# EAGLE design 2Lyonel (EAGLE 7.4.0)
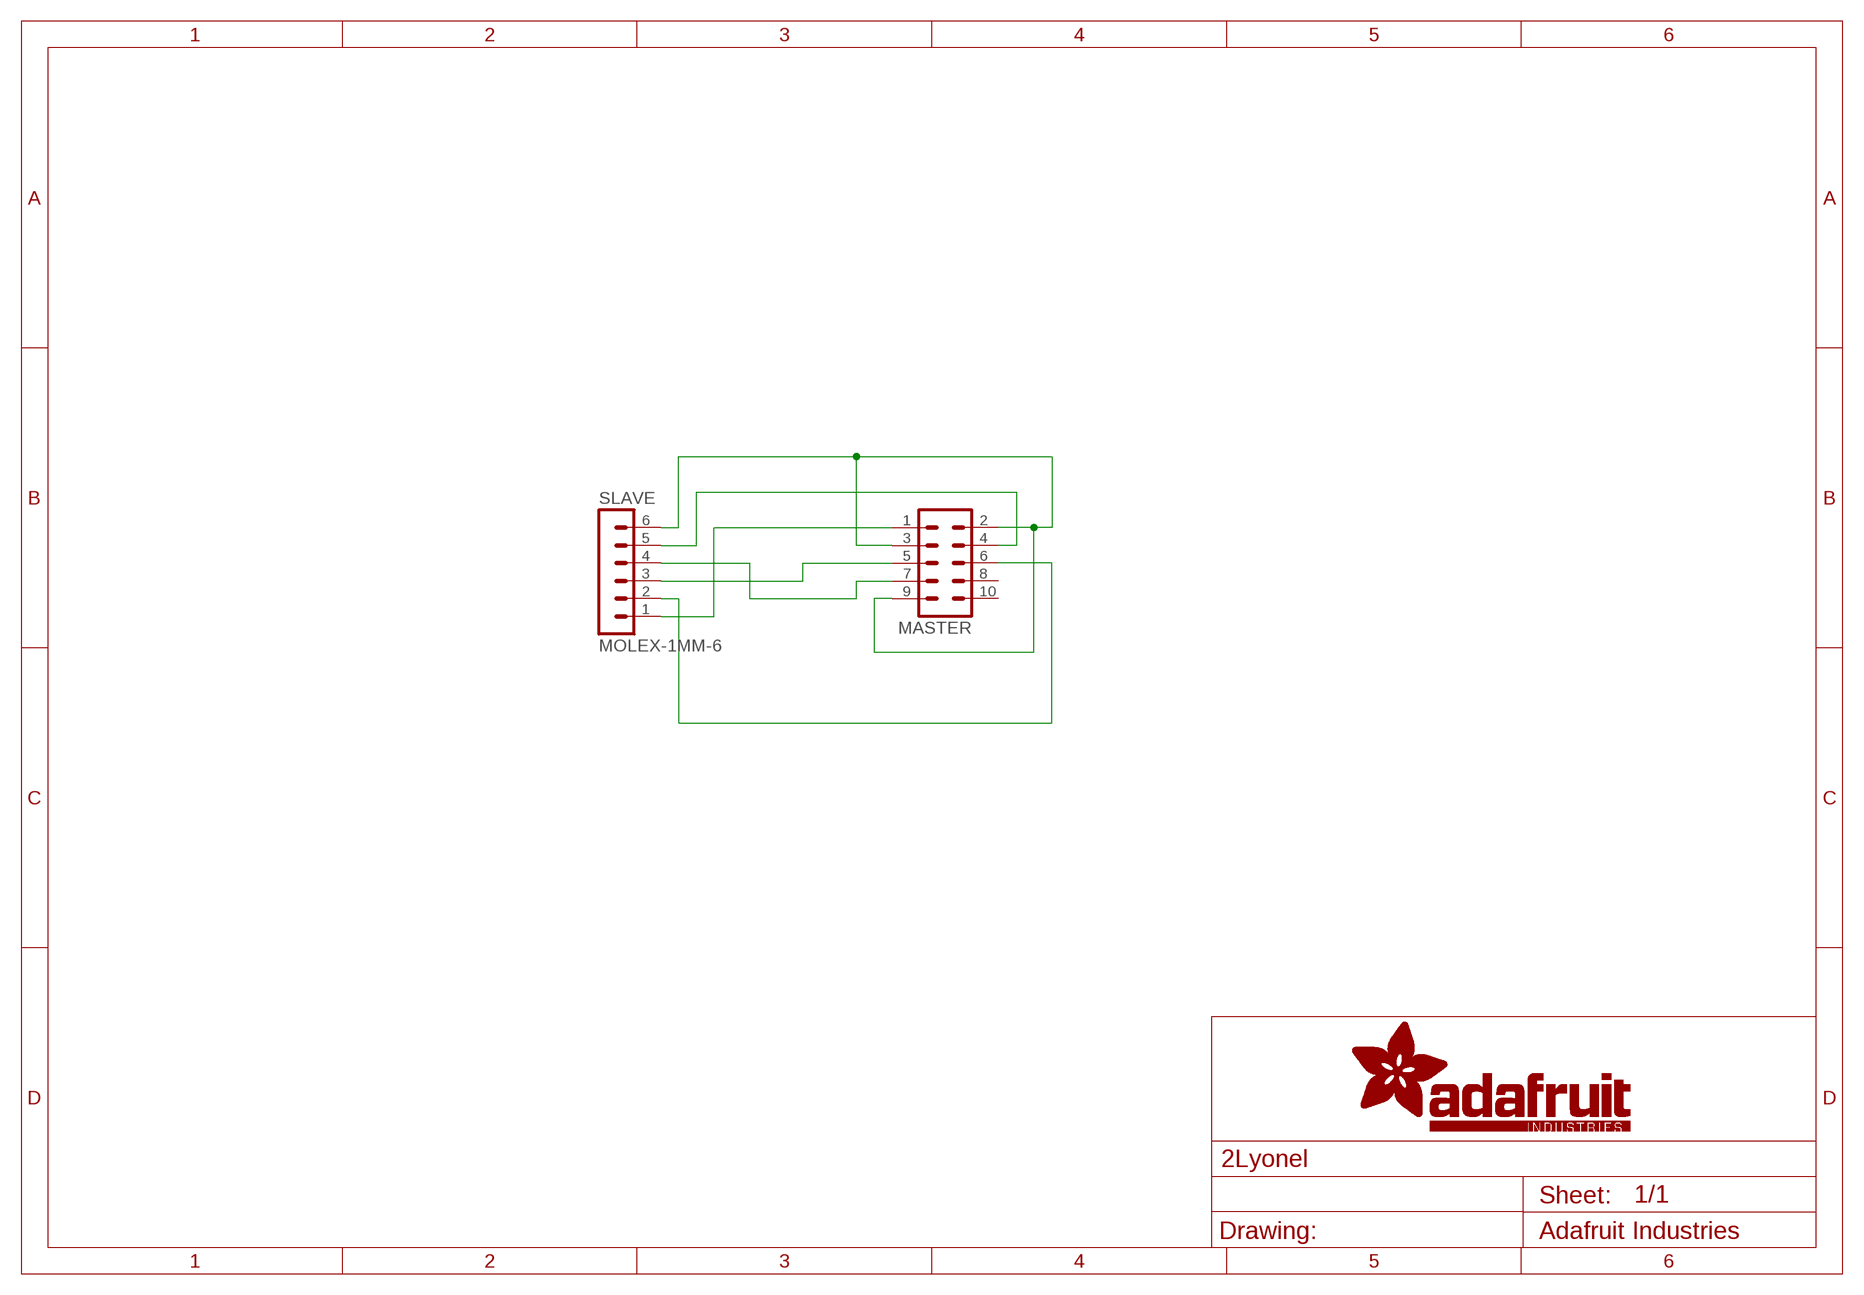
[diagram p0: schematic, sheet 1]

## Parts
MASTER  MA05-2  [MA05-2]
SLAVE  MOLEX-1MM-6  MA06-1  [MOLEX-1MM-6]

## Nets
N$1: MASTER.6 SLAVE.2
N$2: MASTER.1 SLAVE.1
N$3: MASTER.5 SLAVE.3
N$4: MASTER.7 SLAVE.4
N$5: MASTER.4 SLAVE.5
N$6: MASTER.2 MASTER.3 MASTER.9 SLAVE.6
Unconnected: MASTER.8 MASTER.10

## Library data of the parts
MASTER = studio_h:MA05-2: PIN HEADER; MF: TE CONNECTIVITY; MPN: 4-146251-0; Z_DIGIKEY: A117616-ND; Z_MOUSER: 571-4-146251-0
SLAVE = studio_h:MA06-1; MF: MOLEX; MPN: 52207-0633; Z_DIGIKEY: WM10938CT-ND; Z_MOUSER: 538-52207-0633; Z_SMT: Y

## Board
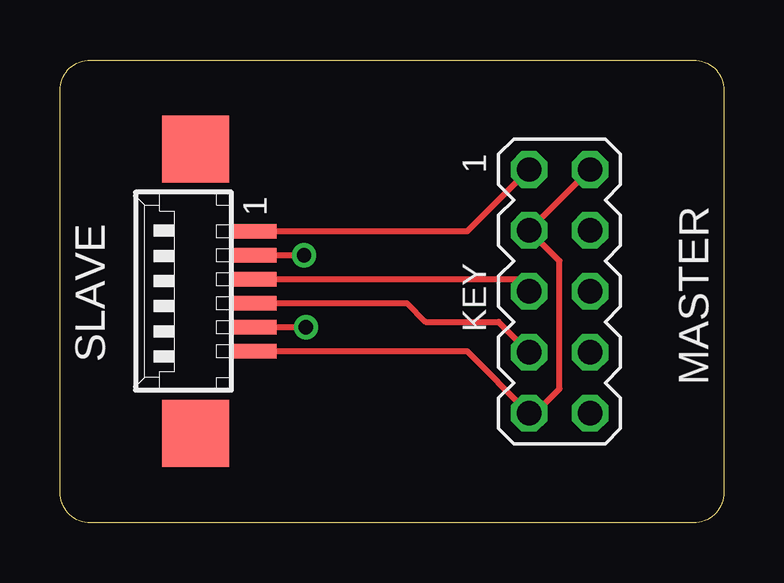
[diagram p1: board, top side]
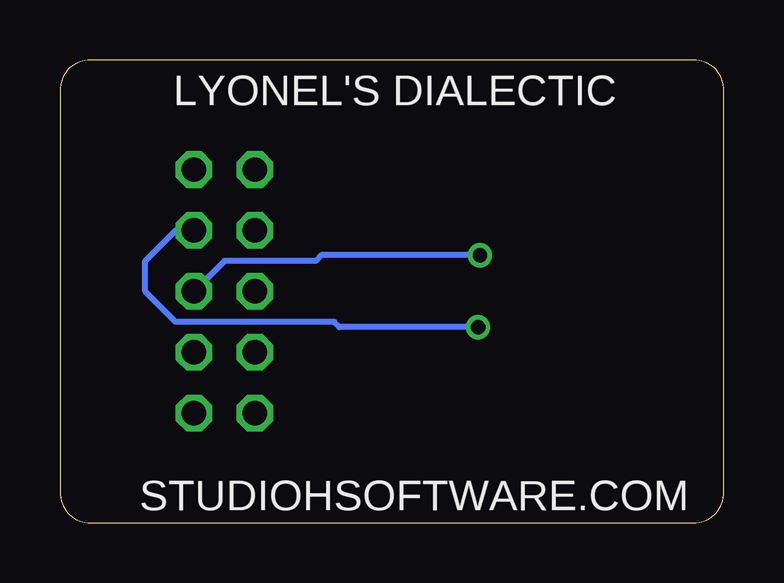
[diagram p2: board, bottom side, seen from below]

Size 27.69 x 19.3 mm. Coordinates in mm from the lower left corner, seen from the top.
Outline: 1.27,19.3 26.42,19.3 arc-90 27.69,18.03 27.69,1.27 arc-90 26.42,0 1.27,0 arc-90 0,1.27 0,18.03 arc-90 1.27,19.3
Copper layers (1*16): Top 0.035mm / dielectric 1.5mm / Bottom 0.035mm
Design rules "adafruit": minimum track width 8mil, minimum drill 15.5mil, track to track 8mil, track to pad 8mil, pad to pad 8mil, via to via 8mil, smd to smd 8mil, copper to edge 10mil, drill to drill 8mil, minimum pad ring 10mil, minimum via ring 8mil, stop-mask expansion 2mil, vias tented up to drill 20mil, thermal gap 10mil

### Footprints (pad centres in the part's own frame; a part is rotated, then mirrored left to right if it is on the bottom)
MA05-2 = drill 1.016 octagon: 1 -5.08,-1.27; 2 -5.08,1.27; 3 -2.54,-1.27; 4 -2.54,1.27; 5 0,-1.27; 6 0,1.27; 7 2.54,-1.27; 8 2.54,1.27; 9 5.08,-1.27; 10 5.08,1.27
MOLEX-1MM-6 = smd 0.6 x 1.9: 1 2,-3; 2 1,-3; 3 0,-3; 4 -1,-3; 5 -2,-3; 6 -3,-3 | smd 2.8 x 2.8: S1 5.425,-0.575; S2 -6.425,-0.575

### Placement (x,y rotation side)
MASTER  20.83,9.65 270 top
SLAVE  5.08,10.16 90 top

### Tracks (layer width: path | path; a pad name or v marks a point on that pad's centre or on a via)
N$1  (via drill 0.6)
  Top 0.254: SLAVE.2 v10.18,11.16
  Bottom 0.254: MASTER.6 20.83,10.92 17.02,10.92 16.78,11.16 v10.18,11.16
N$2
  Top 0.254: SLAVE.1 16.99,12.16 MASTER.1
N$3
  Top 0.254: SLAVE.3 19.05,10.16 MASTER.5
N$4
  Top 0.254: SLAVE.4 14.46,9.16 15.24,8.38 18.29,8.38 MASTER.7
N$5  (via drill 0.6)
  Top 0.254: SLAVE.5 v10.26,8.16
  Bottom 0.254: MASTER.4 22.86,12.19 24.13,10.92 24.13,9.65 22.86,8.38 16.26,8.38 16.03,8.16 v10.26,8.16
N$6
  Top 0.254: SLAVE.6 16.97,7.16 MASTER.9 19.81,4.57 20.83,5.59 20.83,10.92 MASTER.3 MASTER.2

### Text on the board
tPlace: 1 | 1 | KEY
bNames: LYONEL'S DIALECTIC | STUDIOHSOFTWARE.COM